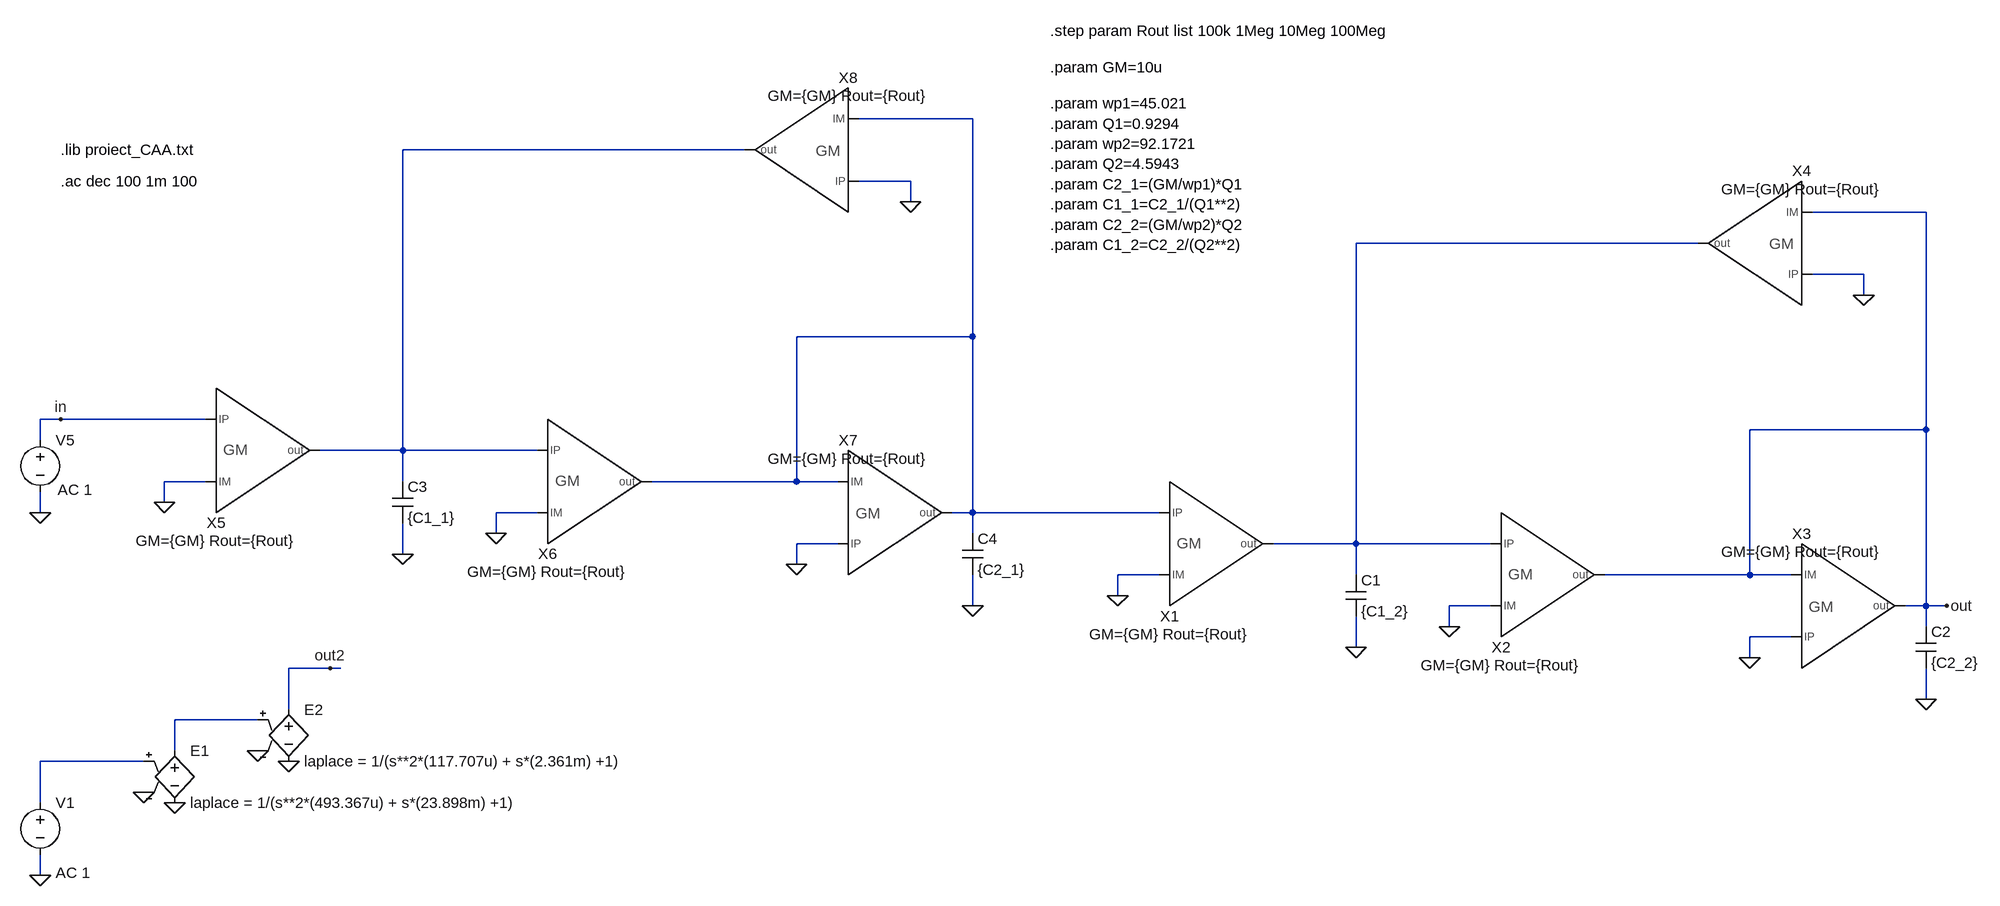
[diagram p0: schematic test_biquad_ideal_deg.asc]
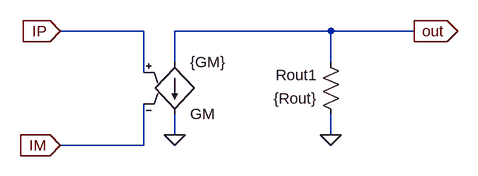
[diagram p1: sub-circuit gm_model.asc]
test_biquad_ideal_deg.asc, the LTspice schematic file:
Version 4
SHEET 1 3600 2552
WIRE 1824 928 1648 928
WIRE 1472 976 944 976
WIRE 1728 1024 1648 1024
WIRE 1728 1056 1728 1024
WIRE 3296 1072 3120 1072
WIRE 2944 1120 2416 1120
WIRE 3200 1168 3120 1168
WIRE 3200 1200 3200 1168
WIRE 1824 1264 1824 928
WIRE 1824 1264 1552 1264
WIRE 416 1392 384 1392
WIRE 640 1392 416 1392
WIRE 3296 1408 3296 1072
WIRE 3296 1408 3024 1408
WIRE 384 1424 384 1392
WIRE 944 1440 944 976
WIRE 944 1440 816 1440
WIRE 1152 1440 944 1440
WIRE 640 1488 576 1488
WIRE 944 1488 944 1440
WIRE 1552 1488 1552 1264
WIRE 1552 1488 1328 1488
WIRE 1616 1488 1552 1488
WIRE 576 1520 576 1488
WIRE 384 1536 384 1504
WIRE 1152 1536 1088 1536
WIRE 1824 1536 1824 1264
WIRE 1824 1536 1792 1536
WIRE 2112 1536 1824 1536
WIRE 1088 1568 1088 1536
WIRE 1824 1568 1824 1536
WIRE 1616 1584 1552 1584
WIRE 2416 1584 2416 1120
WIRE 2416 1584 2288 1584
WIRE 2624 1584 2416 1584
WIRE 944 1600 944 1552
WIRE 1552 1616 1552 1584
WIRE 2112 1632 2048 1632
WIRE 2416 1632 2416 1584
WIRE 3024 1632 3024 1408
WIRE 3024 1632 2800 1632
WIRE 3088 1632 3024 1632
WIRE 2048 1664 2048 1632
WIRE 1824 1680 1824 1632
WIRE 2624 1680 2560 1680
WIRE 3296 1680 3296 1408
WIRE 3296 1680 3264 1680
WIRE 3328 1680 3296 1680
WIRE 2560 1712 2560 1680
WIRE 3296 1712 3296 1680
WIRE 3088 1728 3024 1728
WIRE 2416 1744 2416 1696
WIRE 3024 1760 3024 1728
WIRE 832 1776 768 1776
WIRE 848 1776 832 1776
WIRE 3296 1824 3296 1776
WIRE 768 1840 768 1776
WIRE 720 1856 592 1856
WIRE 592 1904 592 1856
WIRE 544 1920 384 1920
WIRE 384 1984 384 1920
WIRE 384 2096 384 2064
FLAG 416 1392 in
FLAG 384 1536 0
FLAG 944 1600 0
FLAG 1824 1680 0
FLAG 1552 1616 0
FLAG 1088 1568 0
FLAG 576 1520 0
FLAG 1728 1056 0
FLAG 3328 1680 out
FLAG 2416 1744 0
FLAG 3296 1824 0
FLAG 3024 1760 0
FLAG 2560 1712 0
FLAG 2048 1664 0
FLAG 3200 1200 0
FLAG 544 1968 0
FLAG 592 1984 0
FLAG 720 1904 0
FLAG 768 1920 0
FLAG 384 2096 0
FLAG 832 1776 out2
SYMBOL voltage 384 1408 R0
WINDOW 3 29 109 Left 2
WINDOW 123 27 93 Left 2
WINDOW 39 0 0 Left 2
SYMATTR Value ""
SYMATTR Value2 AC 1
SYMATTR InstName V5
SYMBOL cap 928 1488 R0
SYMATTR InstName C3
SYMATTR Value {C1_1}
SYMBOL cap 1808 1568 R0
SYMATTR InstName C4
SYMATTR Value {C2_1}
SYMBOL gm_model 688 1440 M180
WINDOW 39 -32 -124 Bottom 2
SYMATTR SpiceLine GM={GM} Rout={Rout}
SYMATTR InstName X5
SYMBOL gm_model 1200 1488 M180
WINDOW 39 -32 -124 Bottom 2
SYMATTR SpiceLine GM={GM} Rout={Rout}
SYMATTR InstName X6
SYMBOL gm_model 1664 1536 R0
WINDOW 39 -32 -68 Bottom 2
SYMATTR SpiceLine GM={GM} Rout={Rout}
SYMATTR InstName X7
SYMBOL gm_model 1600 976 M0
WINDOW 39 -32 -68 Bottom 2
SYMATTR SpiceLine GM={GM} Rout={Rout}
SYMATTR InstName X8
SYMBOL cap 2400 1632 R0
SYMATTR InstName C1
SYMATTR Value {C1_2}
SYMBOL cap 3280 1712 R0
SYMATTR InstName C2
SYMATTR Value {C2_2}
SYMBOL gm_model 2160 1584 M180
WINDOW 39 -32 -124 Bottom 2
SYMATTR SpiceLine GM={GM} Rout={Rout}
SYMATTR InstName X1
SYMBOL gm_model 2672 1632 M180
WINDOW 39 -32 -124 Bottom 2
SYMATTR SpiceLine GM={GM} Rout={Rout}
SYMATTR InstName X2
SYMBOL gm_model 3136 1680 R0
WINDOW 39 -32 -68 Bottom 2
SYMATTR SpiceLine GM={GM} Rout={Rout}
SYMATTR InstName X3
SYMBOL gm_model 3072 1120 M0
WINDOW 39 -32 -68 Bottom 2
SYMATTR SpiceLine GM={GM} Rout={Rout}
SYMATTR InstName X4
SYMBOL e 592 1888 R0
SYMATTR InstName E1
SYMATTR Value laplace = 1/(s**2*(493.367u) + s*(23.898m) +1)
SYMBOL e 768 1824 R0
SYMATTR InstName E2
SYMATTR Value laplace = 1/(s**2*(117.707u) + s*(2.361m) +1)
SYMBOL voltage 384 1968 R0
WINDOW 123 24 124 Left 2
WINDOW 39 0 0 Left 0
WINDOW 3 24 44 Left 2
SYMATTR Value2 AC 1
SYMATTR Value ""
SYMATTR InstName V1
TEXT 416 976 Left 2 !.lib proiect_CAA.txt
TEXT 416 1024 Left 2 !.ac dec 100 1m 100
TEXT 1944 792 Left 2 !.step param Rout list 100k 1Meg 10Meg 100Meg
TEXT 1944 848 Left 2 !.param GM=10u
TEXT 1944 904 Left 2 !.param wp1=45.021\n.param Q1=0.9294\n.param wp2=92.1721\n.param Q2=4.5943\n.param C2_1=(GM/wp1)*Q1\n.param C1_1=C2_1/(Q1**2)\n.param C2_2=(GM/wp2)*Q2\n.param C1_2=C2_2/(Q2**2)

gm_model.asc, the sub-circuit schematic file:
Version 4
SHEET 1 1088 852
WIRE 0 352 -128 352
WIRE 288 352 48 352
WIRE 416 352 288 352
WIRE 48 400 48 352
WIRE 288 400 288 352
WIRE 0 416 0 352
WIRE 48 512 48 480
WIRE 288 512 288 480
WIRE 0 528 0 464
WIRE 0 528 -128 528
FLAG -128 352 IP
IOPIN -128 352 In
FLAG -128 528 IM
IOPIN -128 528 In
FLAG 48 512 0
FLAG 416 352 out
IOPIN 416 352 Out
FLAG 288 512 0
SYMBOL g2 48 496 M180
SYMATTR InstName GM
SYMATTR Value {GM}
SYMBOL res 304 496 R180
WINDOW 0 36 76 Left 2
WINDOW 3 36 40 Left 2
SYMATTR InstName Rout1
SYMATTR Value {Rout}

The netlist it stands for:
* test_biquad_ideal_deg.asc
V5 in 0 AC 1
C3 N002 0 {C1_1}
C4 N001 0 {C2_1}
XX5 0 in N002 gm_model params: GM={GM} Rout={Rout}
XX6 0 N002 N001 gm_model params: GM={GM} Rout={Rout}
XX7 N001 0 N001 gm_model params: GM={GM} Rout={Rout}
XX8 N001 0 N002 gm_model params: GM={GM} Rout={Rout}
C1 N003 0 {C1_2}
C2 out 0 {C2_2}
XX1 0 N001 N003 gm_model params: GM={GM} Rout={Rout}
XX2 0 N003 out gm_model params: GM={GM} Rout={Rout}
XX3 out 0 out gm_model params: GM={GM} Rout={Rout}
XX4 out 0 N003 gm_model params: GM={GM} Rout={Rout}
E1 N004 0 N005 0 laplace = 1/(s**2*(493.367u) + s*(23.898m) +1)
E2 out2 0 N004 0 laplace = 1/(s**2*(117.707u) + s*(2.361m) +1)
V1 N005 0 AC 1

* block symbol definitions
.subckt gm_model IM IP out
GM out 0 IP IM {GM}
Rout1 0 out {Rout}
.ends gm_model

.lib proiect_CAA.txt
.ac dec 100 1m 100
.step param Rout list 100k 1Meg 10Meg 100Meg
.param GM=10u
.param wp1=45.021
.param Q1=0.9294
.param wp2=92.1721
.param Q2=4.5943
.param C2_1=(GM/wp1)*Q1
.param C1_1=C2_1/(Q1**2)
.param C2_2=(GM/wp2)*Q2
.param C1_2=C2_2/(Q2**2)
.backanno
.end